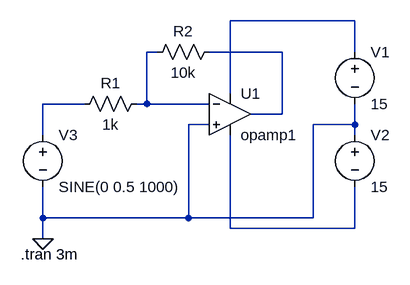
[diagram p0: schematic Draft1.asc]
Draft1.asc, the LTspice schematic file:
Version 4
SHEET 1 880 680
WIRE 176 -144 -16 -144
WIRE -128 -96 -144 -96
WIRE 64 -96 -48 -96
WIRE 176 -96 176 -144
WIRE -16 -32 -16 -144
WIRE -240 -16 -304 -16
WIRE -144 -16 -144 -96
WIRE -144 -16 -160 -16
WIRE -48 -16 -144 -16
WIRE 64 0 64 -96
WIRE 64 0 16 0
WIRE -48 16 -80 16
WIRE 176 16 176 -16
WIRE 176 16 112 16
WIRE -304 32 -304 -16
WIRE 176 32 176 16
WIRE -304 160 -304 112
WIRE -80 160 -80 16
WIRE -80 160 -304 160
WIRE 112 160 112 16
WIRE 112 160 -80 160
WIRE -16 176 -16 32
WIRE 176 176 176 112
WIRE 176 176 -16 176
WIRE -304 192 -304 160
FLAG -304 192 0
SYMBOL res -144 -32 R90
WINDOW 0 0 56 VBottom 2
WINDOW 3 32 56 VTop 2
SYMATTR InstName R1
SYMATTR Value 1k
SYMBOL res -32 -112 R90
WINDOW 0 0 56 VBottom 2
WINDOW 3 32 56 VTop 2
SYMATTR InstName R2
SYMATTR Value 10k
SYMBOL voltage 176 -112 R0
WINDOW 123 0 0 Left 0
WINDOW 39 0 0 Left 0
SYMATTR InstName V1
SYMATTR Value 15
SYMBOL voltage 176 16 R0
WINDOW 123 0 0 Left 0
WINDOW 39 0 0 Left 0
SYMATTR InstName V2
SYMATTR Value 15
SYMBOL voltage -304 16 R0
WINDOW 123 0 0 Left 0
WINDOW 39 0 0 Left 0
SYMATTR InstName V3
SYMATTR Value SINE(0 0.5 1000)
SYMBOL OpAmps\\opamp2 -16 -64 R0
SYMATTR InstName U1
SYMATTR Value opamp1
TEXT -338 216 Left 2 !.tran 3m

The netlist it stands for:
* Draft1.asc
R1 N002 N004 1k
R2 N003 N002 10k
V1 N001 0 15
V2 0 N005 15
V3 N004 0 SINE(0 0.5 1000)
XU1 0 N002 N001 N005 N003 opamp1  ; pins In+ In- V+ V- OUT
.tran 3m
.backanno
.end